# EAGLE design kitt (EAGLE 7.6.0)
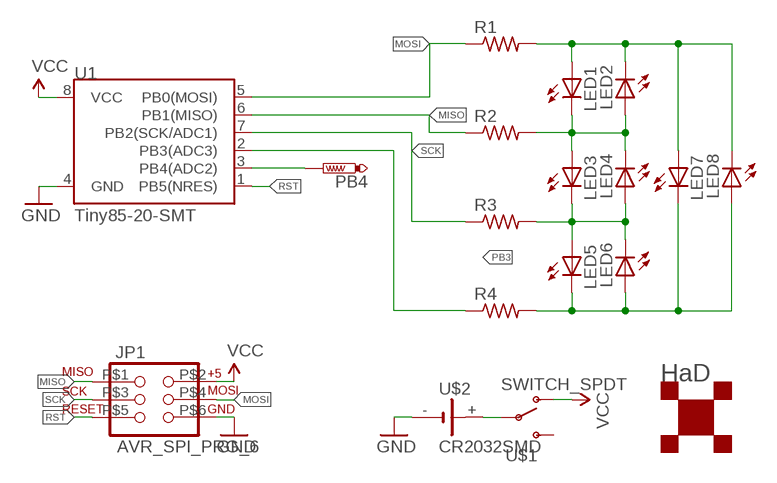
[diagram p0: schematic, sheet 1]

## Parts
JP1  AVR_SPI_PRG_6  [2X3_SMD_PAD]
LED1  LEDCHIPLED-0603-TTW  [CHIPLED-0603-TTW]
LED2  LEDCHIPLED-0603-TTW  [CHIPLED-0603-TTW]
LED3  LEDCHIPLED-0603-TTW  [CHIPLED-0603-TTW]
LED4  LEDCHIPLED-0603-TTW  [CHIPLED-0603-TTW]
LED5  LEDCHIPLED-0603-TTW  [CHIPLED-0603-TTW]
LED6  LEDCHIPLED-0603-TTW  [CHIPLED-0603-TTW]
LED7  LEDCHIPLED-0603-TTW  [CHIPLED-0603-TTW]
LED8  LEDCHIPLED-0603-TTW  [CHIPLED-0603-TTW]
PB4  PTR1B1,27  [B1,27]
R1  R-US_R0603  [R0603]
R2  R-US_R0603  [R0603]
R3  R-US_R0603  [R0603]
R4  R-US_R0603  [R0603]
U1  Tiny85-20-SMT  ATTINY45TINY85-20-SMT  [SO08-EIAJ]
U$1  SWITCH_SPDT  [KPS-1290]
U$2  CR2032SMD  [CR2032SMD]
U$3  HACKADAY_1CM  [HACKADAY_LOGO]

## Nets
MISO: JP1.P$1 R2.1 U1.6(PB1(MISO))
MOSI: JP1.P$4 R1.1 U1.5(PB0(MOSI))
N$1: PB4.TP U1.3(PB4(ADC2))
N$5: U$1.P U$2.+
N$9: LED1.A@1(A) LED2.C@1(C) LED7.A@1(A) LED8.C@1(C) R1.2
N$10: LED5.C@1(C) LED6.A@1(A) LED7.C@1(C) LED8.A@1(A) R4.2
N$11: LED1.C@1(C) LED2.A@1(A) LED3.A@1(A) LED4.C@1(C) R2.2
N$12: LED3.C@1(C) LED4.A@1(A) LED5.A@1(A) LED6.C@1(C) R3.2
N$12222: JP1.P$6 U1.4(GND) U$2.- ; supply symbol labelled GND
PB3: R4.1 U1.2(PB3(ADC3))
RST: JP1.P$5 U1.1(PB5(NRES))
SCK: JP1.P$3 R3.1 U1.7(PB2(SCK/ADC1))
VCC: JP1.P$2 U1.8(VCC) U$1.O
Unconnected: U$1.S

## Library data of the parts
JP1 = SparkFun-Connectors:AVR_SPI_PRG_6: AVR ISP 6 Pin This is the reduced ISP connector for AVR programming. Common on Arduino. This footprint will take up less PCB space and can be used with a 10-pin to 6-pin adapter such as SKU: BOB-08508 **Special note about "TEST_POINT" package. The stop mask is on the top side, so if you want your programming test points to be on the bottom of your board, make sure to place this package on the bottom side of the board. This also ensure that the orientation to program from the bottom side will be correct.
LED1-LED8 = adafruit:LED: LED OSRAM: - CHIPLED LG R971, LG N971, LY N971, LG Q971, LY Q971, LO R971, LY R971 LH N974, LH R974 LS Q976, LO Q976, LY Q976 LO Q996 - Hyper CHIPLED LW Q18S LB Q993, LB Q99A, LB R99A - SideLED LS A670, LO A670, LY A670, LG A670, LP A670 LB A673, LV A673, LT A673, LW A673 LH A674 LY A675 LS A676, LA A676, LO A676, LY A676, LW A676 LS A679, LY A679, LG A679 - Hyper Micro SIDELED® LS Y876, LA Y876, LO Y876, LY Y876 LT Y87S - SmartLED LW L88C, LW L88S LB L89C, LB L89S, LG L890 LS L89K, LO L89K, LY L89K LS L896, LA L896, LO L896, LY L896 - TOPLED LS T670, LO T670, LY T670, LG T670, LP T670 LSG T670, LSP T670, LSY T670, LOP T670, LYG T670 LG T671, LOG T671, LSG T671 LB T673, LV T673, LT T673, LW T673 LH T674 LS T676, LA T676, LO T676, LY T676, LB T676, LH T676, LSB T676, LW T676 LB T67C, LV T67C, LT T67C, LS T67K, LO T67K, LY T67K, LW E67C LS E67B, LA E67B, LO E67B, LY E67B, LB E67C, LV E67C, LT E67C LW T67C LS T679, LY T679, LG T679 LS T770, LO T770, LY T770, LG T770, LP T770 LB T773, LV T773, LT T773, LW T773 LH T774 LS E675, LA E675, LY E675, LS T675 LS T776, LA T776, LO T776, LY T776, LB T776 LHGB T686 LT T68C, LB T68C - Hyper Mini TOPLED® LB M676 - Mini TOPLED Santana® LG M470 LS M47K, LO M47K, LY M47K Source: http://www.osram.convergy.de/
PB4 = testpad:PTR1: TEST PIN
R1-R4 = adafruit:R-US_: RESISTOR, American symbol
U1 = SparkFun-DigitalIC:ATTINY45: Atmel 8-pin 2/4/8kB flash uC; PROD_ID: IC-09092
U$1 = SparkFun-Electromechanical:SWITCH_SPDT: SWCH-10651 Side-actuated SPDT slide switch, as used on the Arduino Pro; PROD_ID: SWCH-10651
U$2 = battery:CR2032SMD
U$3 = LOGOS:HACKADAY_1CM

## Board
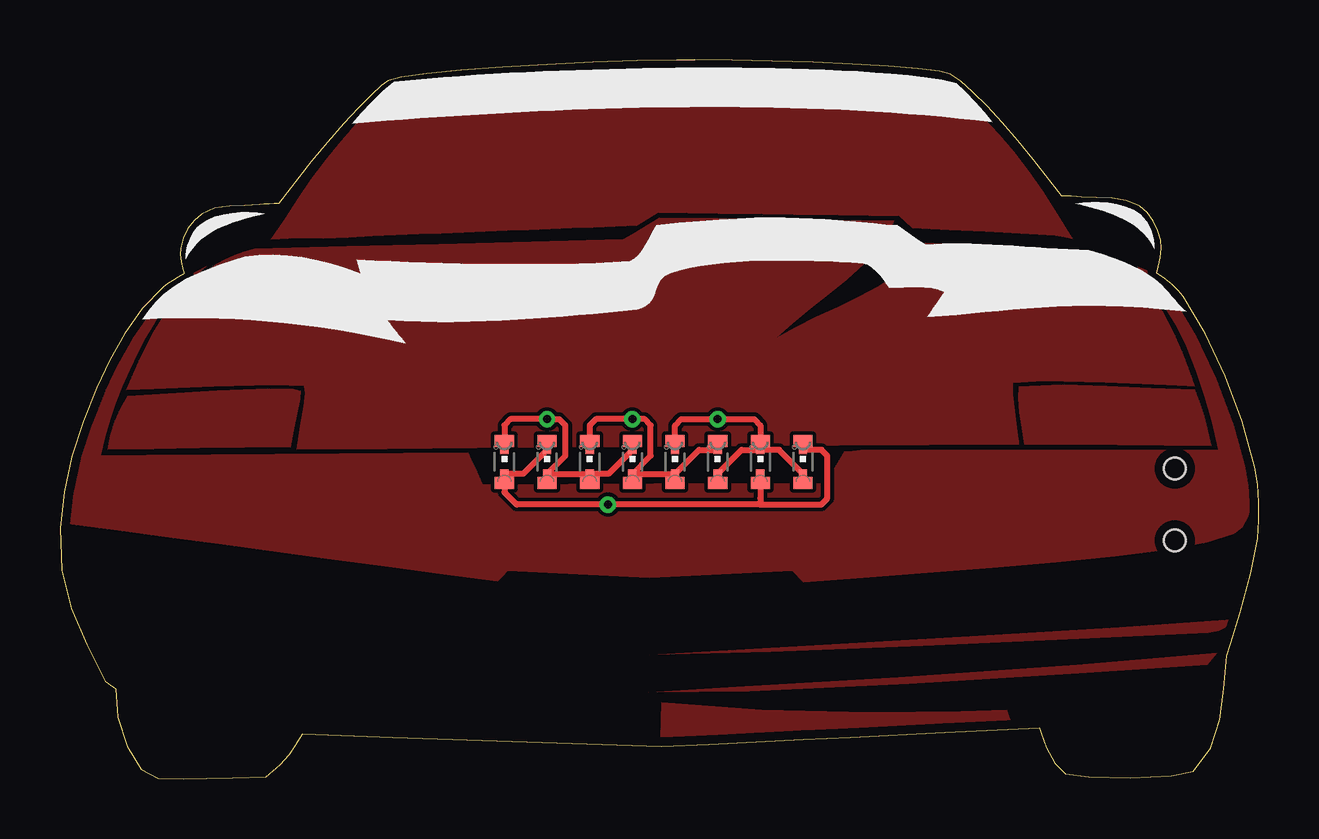
[diagram p1: board, top side]
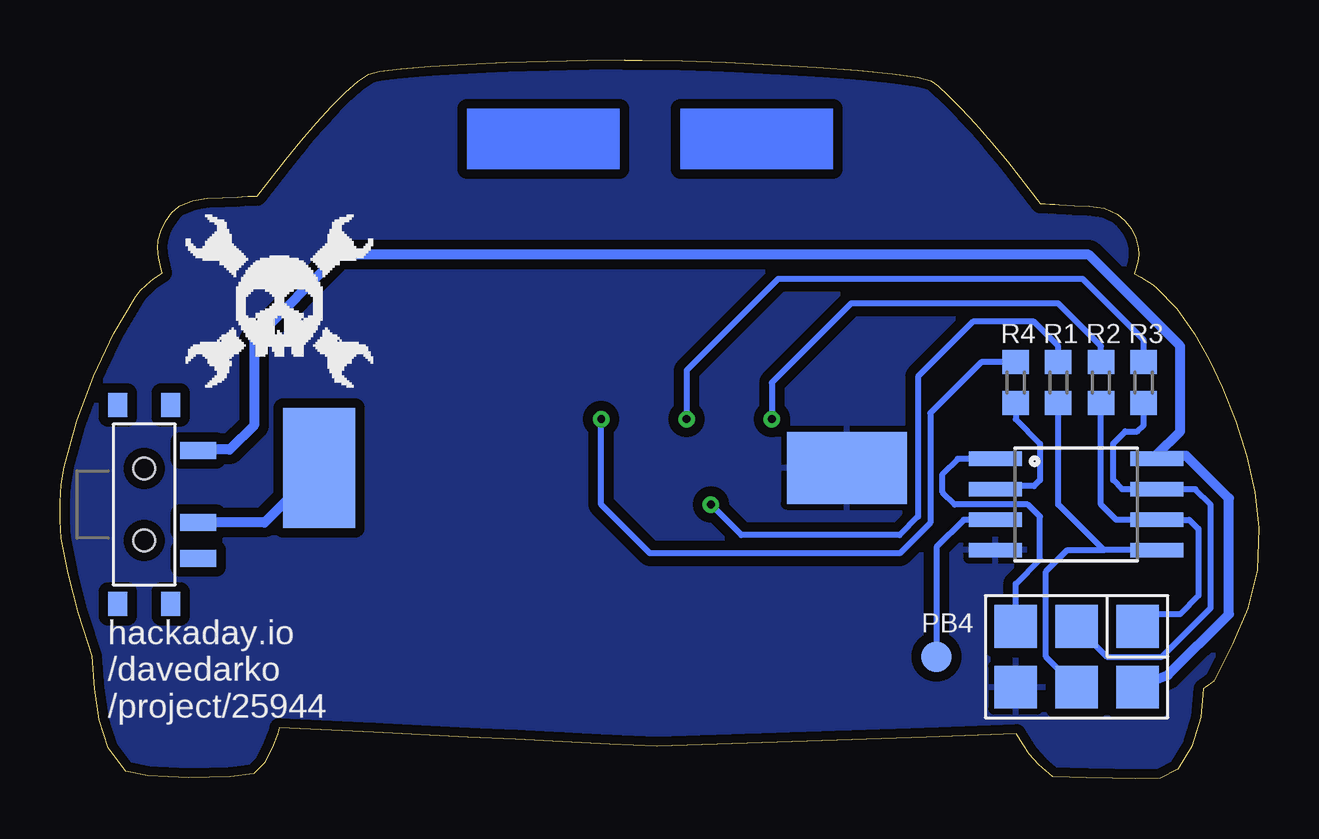
[diagram p2: board, bottom side, seen from below]

Size 49.98 x 29.96 mm. Coordinates in mm from the lower left corner, seen from the top.
Outline: 26.44,29.96 26.34,29.96 26.25,29.96 26.15,29.96 26.06,29.96 25.96,29.96 25.87,29.96 25.78,29.96 25.69,29.96 24.05,29.93 22.22,29.86 20.31,29.77 18.44,29.66 16.72,29.54 15.28,29.4 14.22,29.25 13.67,29.1 13.39,28.89 12.96,28.5 12.43,27.96 11.82,27.3 11.15,26.54 10.46,25.72 9.11,23.97 8.92,23.96 8.71,23.95 8.51,23.94 8.33,23.93 7.7,23.89 7.07,23.87 6.45,23.78 5.9,23.54 5.58,23.26 5.33,22.92 5.14,22.53 5.02,22.13 5.01,21.86 5.06,21.55 5.12,21.26 5.19,21.05 4.93,20.91 4.7,20.77 4.49,20.63 4.3,20.49 3.42,19.59 2.69,18.56 2.07,17.45 1.53,16.31 0.96,14.9 0.5,13.44 0.17,11.95 0,10.44 0.07,8.68 0.47,7.11 1.11,5.6 1.89,4.05 2,3.97 2.11,3.89 2.22,3.82 2.32,3.74 2.42,2.56 2.8,1.35 3.39,0.4 4.1,0.01 5.16,0 6.12,0.01 7.19,0.04 8.59,0.08 9.18,0.57 9.57,1.01 9.85,1.44 10.12,1.86 13.86,1.73 15.73,1.66 17.6,1.6 19.47,1.53 21.34,1.47 23.21,1.4 25.08,1.34 27.05,1.44 29.02,1.53 30.99,1.63 32.96,1.73 36.89,1.93 40.83,2.13 40.91,1.87 41.12,1.29 41.46,0.65 41.9,0.2 42.88,0.07 44.61,0.04 46.32,0.11 47.24,0.3 47.96,1.28 48.34,2.45 48.52,3.75 48.63,5.12 48.81,5.65 49.21,6.94 49.64,8.55 49.92,10.02 49.97,10.76 49.98,11.51 49.92,12.25 49.79,12.99 49.27,14.89 48.58,16.79 47.75,18.56 46.83,20.09 46.62,20.35 46.37,20.6 46.06,20.84 45.72,21.08 45.79,21.36 45.86,21.72 45.9,22.11 45.88,22.45 45.75,22.86 45.57,23.24 45.32,23.59 45,23.86 44.45,24.1 43.83,24.2 43.2,24.22 42.57,24.25 42.38,24.27 42.16,24.28 41.94,24.29 41.75,24.29 40.57,25.82 39.93,26.59 39.28,27.34 38.65,28.03 38.06,28.61 37.54,29.08 37.12,29.38 36.66,29.49 35.76,29.6 34.52,29.7 33.04,29.79 31.39,29.86 29.68,29.92 28,29.95 26.44,29.96
Outline: 26.44,29.96 26.44,29.96
Outline: 26.44,29.96 26.44,29.96
Copper layers (1*16): Top 0.0356mm / dielectric 1.5011mm / Bottom 0.0356mm
Design rules "LaenPCBOrder *": minimum track width 6mil, minimum drill 13mil, track to track 6mil, track to pad 6mil, pad to pad 6mil, via to via 6mil, smd to smd 6mil, copper to edge 15mil, drill to drill 6mil, minimum pad ring 7mil, minimum via ring 7mil, stop-mask expansion 3mil, vias tented up to drill 200mil, thermal gap 10mil

### Footprints (pad centres in the part's own frame; a part is rotated, then mirrored left to right if it is on the bottom)
2X3_SMD_PAD = smd 1.778 x 1.778: P$1 -1.27,2.54; P$2 1.27,2.54; P$3 -1.27,0; P$4 1.27,0; P$5 -1.27,-2.54; P$6 1.27,-2.54
CHIPLED-0603-TTW = smd 0.8 x 0.5: A 0,-0.875; C 0,0.875 | smd 0.35 x 0.35: A@1 0,-0.5; C@1 0,0.5
B1,27 = smd 1.27 x 1.27: TP 0,0
R0603 = smd 1 x 1.1: 1 -0.85,0; 2 0.85,0
SO08-EIAJ = smd 0.61 x 2.21: 1 -1.905,-3.378; 2 -0.635,-3.378; 3 0.635,-3.378; 4 1.905,-3.378; 5 1.905,3.353; 6 0.635,3.353; 7 -0.635,3.353; 8 -1.905,3.353
KPS-1290 = smd 0.7 x 1.5: O -2.25,2.25; P 0.75,2.25; S 2.25,2.25 | smd 1 x 0.8: P$1 -4.15,1.1; P$2 -4.15,-1.1; P$3 4.15,-1.1; P$4 4.15,1.1 | hole 0.9: -1.5,0; 1.5,0
CR2032SMD = smd 5 x 3: + 0,-11 | smd 3 x 5: - 0,11

### Placement (x,y rotation side)
JP1  7.6,5.08 270 bottom
LED1  18.52,13.21 0 top
LED2  20.3,13.21 0 top
LED3  22.08,13.21 0 top
LED4  23.86,13.21 0 top
LED5  25.64,13.21 0 top
LED6  27.41,13.21 0 top
LED7  29.19,13.21 0 top
LED8  30.97,13.21 0 top
PB4  13.44,5.08 0 bottom
R1  8.36,16.51 90 bottom
R2  6.59,16.51 90 bottom
R3  4.81,16.51 90 bottom
R4  10.14,16.51 90 bottom
U1  7.6,11.43 270 bottom
U$1  46.46,11.43 270 bottom
U$2  28.18,12.95 270 bottom
U$3  40.88,19.56 0 bottom

### Tracks (layer width: path | path; a pad name or v marks a point on that pad's centre or on a via)
MISO
  Bottom 0.254: R2.1 6.59,11.43 5.95,10.79 U1.6 2.9,10.79 2.52,10.41 2.52,7.62 3.28,6.86 4.81,6.86 JP1.P$1
MOSI
  Bottom 0.254: U1.5 5.32,9.52 6.46,9.52 | 6.46,9.52 8.36,11.43 R1.1 | JP1.P$4 8.87,5.08 8.87,8.64 7.98,9.52 6.46,9.52
N$1
  Bottom 0.254: U1.3 12.3,10.79 13.44,9.65 PB4.TP
N$5
  Bottom 0.406: U$2.+ 41.45,10.68 U$1.P
N$6
  pour Top: 25.07,3.19 25.05,2.43 25.03,1.67 28.7,1.82 32.36,1.97 36.03,2.12 39.7,2.27 39.58,2.57 39.46,2.86 37.56,2.8 33.78,2.77 29.24,2.86
  pour Top: 6.11,21.36 4.76,20.66 3.6,19.55 2.63,18.17 1.83,16.68 1.29,15.19 0.78,13.69 0.57,12.94 0.39,12.18 0.26,11.42 0.18,10.65 2.43,10.34 4.69,10.04 6.95,9.73 9.21,9.43 11.47,9.13 13.72,8.82 15.98,8.52 18.24,8.21 18.45,8.44 18.66,8.67 24.57,8.37 30.53,8.67 30.99,8.18 33.46,8.38 36.13,8.58 38.85,8.79 41.51,9.01 43.98,9.26 46.12,9.53 47.81,9.84 48.92,10.19 49.28,10.47 49.52,10.89 49.66,11.37 49.7,11.85 49.59,12.99 49.3,14.24 48.89,15.54 48.44,16.81 47.99,17.82 47.5,18.77 46.95,19.65 46.36,20.47 45.97,20.8 45.6,21.04 45.24,21.22 44.9,21.35 45.46,20.57 46,19.75 46.5,18.9 46.94,18.02 47.37,16.98 47.73,15.91 48.02,14.82 48.27,13.73 40.83,13.71 33.39,13.69 33.05,13.66 32.71,13.63 32.3,12.98 31.9,12.33 24.76,12.3 17.62,12.27 17.47,12.6 17.32,12.93 17.16,13.26 17.01,13.6 3.61,13.48 1.7,13.47 1.88,14.26 2.09,14.98 2.33,15.66 2.59,16.35 2.9,17.03 3.27,17.78 3.58,18.38 3.71,18.62 4.17,19.38 4.74,20.08 5.39,20.73
  pour Top: 2.77,16.19 3.9,16.25 6.4,16.35 8.94,16.42 10.18,16.37 10.23,16.08 10.15,15.51 10,14.71 9.87,13.73 13.63,13.75 17.39,13.78 21.16,13.81 28.68,13.86 32.45,13.88 36.21,13.91 39.97,13.94 39.97,14.04 39.93,14.31 39.82,15.14 39.72,16.01 39.73,16.49 40.98,16.58 43.58,16.52 46.14,16.41 46.98,16.37 47.3,16.35 47.08,16.98 46.78,17.76 46.4,18.62 45.94,19.49 45.4,20.32 44.78,21.04 44.07,21.59 43.28,21.9 42.38,21.96 41.48,22.01 39.68,22.13 37.88,22.24 36.08,22.35 34.89,21.05 34.13,20.54 33.3,20.09 32.42,19.67 31.54,19.26 30.67,18.83 29.85,18.36 30.54,18.98 31.29,19.59 32.06,20.2 32.81,20.81 33.49,21.43 34.08,22.04 34.78,23.26 32.33,23.29 29.88,23.33 27.44,23.36 24.99,23.39 24.61,23.17 24.24,22.94 23.87,22.71 23.49,22.48 19.65,22.39 15.81,22.29 11.96,22.19 8.12,22.09 7.68,21.98 7.28,21.83 6.9,21.67 6.55,21.48 5.9,21.03 5.3,20.51 4.5,19.57 3.84,18.53 3.28,17.4
  pour Top: 2.82,15.96 6.56,16.17 8.73,16.26 9.74,16.25 10.02,16.15 10.01,15.82 9.89,15.22 9.74,14.52 9.61,13.82 7.71,13.8 5.8,13.77 3.9,13.75 1.99,13.72 2.1,14.31 2.29,14.89 2.54,15.46
  pour Top: 8.79,22.47 9.9,22.53 10.97,22.52 12,22.56 13.01,22.61 13.99,22.65 14.95,22.69 15.89,22.73 16.82,22.77 17.73,22.8 18.63,22.84 19.53,22.87 20.43,22.91 21.32,22.94 22.23,22.98 23.14,23.01 24.06,23.05 24.5,23.32 24.93,23.6 25.56,23.59 26.18,23.58 26.81,23.57 27.43,23.57 28.06,23.56 28.68,23.55 29.31,23.54 29.93,23.53 30.56,23.52 31.19,23.51 31.83,23.51 32.46,23.5 33.09,23.49 33.72,23.48 34.35,23.47 34.98,23.46 35.25,23.21 35.53,22.96 37.07,22.88 38.58,22.8 40.05,22.72 41.49,22.64 41.86,22.57 42.23,22.5 41.58,23.54 40.97,24.49 40.37,25.35 39.76,26.14 39.14,26.87 38.48,27.55 37.77,28.2 37,28.83 36.55,28.99 35.71,29.12 34.52,29.24 33.03,29.33 32.2,29.37 31.32,29.4 30.4,29.43 29.44,29.45 28.45,29.47 27.43,29.48 26.41,29.48 25.38,29.48 24.34,29.47 23.32,29.46 22.31,29.44 21.32,29.42 20.36,29.39 19.43,29.36 18.55,29.32 17.72,29.27 16.24,29.16 15.05,29.03 14.21,28.87 13.77,28.69 13.03,28.01 12.34,27.3 11.69,26.56 11.07,25.78 10.48,24.98 9.9,24.15 9.34,23.29
  pour Top: 39.97,16.35 41.8,16.42 43.64,16.38 45.47,16.29 47.3,16.22 47.5,15.67 47.69,15.1 47.85,14.5 47.98,13.87 46.04,13.89 44.09,13.91 42.14,13.92 40.2,13.94 40.09,14.62 39.99,15.27 39.94,15.86
N$7
  pour Top: 24.57,5.16 29.62,5.29 35.97,5.53 42.45,5.82 47.87,6.08 48.29,6.16 48.56,6.29 48.73,6.46 48.88,6.63 44.15,6.3 37.93,5.93 31.1,5.54
N$8
  pour Top: 24.52,3.6 28.71,3.64 35.39,3.96 42.46,4.38 47.82,4.75 47.93,4.87 48.03,5 48.13,5.13 48.23,5.25 42.39,4.74 34.94,4.23 28.21,3.82
N$9  (via drill 0.33)
  Top 0.254: 29.19,11.68 LED7.A@1 29.19,11.43 | 29.19,11.43 31.73,11.43 31.99,11.68 31.99,13.46 31.74,13.71 LED8.C@1 | 29.19,11.43 v22.84,11.43 19.03,11.43 18.52,11.94 LED1.A@1 19.3,12.71 LED2.C@1
  Bottom 0.254: R1.2 8.36,18.03 9.38,19.05 11.92,19.05 14.21,16.76 14.21,10.92 14.97,10.16 21.57,10.16 v22.84,11.43
N$10  (via drill 0.33)
  Top 0.254: LED6.A@1 28.41,13.71 LED7.C@1 | LED8.A@1 29.97,13.71 LED7.C@1 | LED5.C@1 25.64,14.73 25.89,14.99 v27.41,14.99 28.94,14.99 29.19,14.73 LED7.C@1
  Bottom 0.254: R4.2 11.58,17.36 13.7,15.24 13.7,10.67 14.97,9.4 25.38,9.4 27.41,11.43 v27.41,14.99
N$11  (via drill 0.33)
  Top 0.254: LED4.C@1 22.86,12.71 LED3.A@1 LED2.A@1 21.06,13.46 21.06,14.73 20.81,14.99 v20.3,14.99 18.78,14.99 18.52,14.73 LED1.C@1
  Bottom 0.254: R2.2 6.59,18.03 8.36,19.81 17,19.81 20.3,16.51 v20.3,14.99
N$12  (via drill 0.33)
  Top 0.254: LED6.C@1 26.64,13.71 LED5.A@1 LED4.A@1 24.62,13.47 24.62,14.73 24.37,14.99 v23.86,14.99 22.33,14.99 22.08,14.73 LED3.C@1
  Bottom 0.254: R3.2 4.81,18.29 7.35,20.83 20.05,20.83 23.86,17.02 v23.86,14.99
N$12222
  pour Bottom (isolate 0.406): -2.56,33.02 50.78,33.02 50.78,-2.54 -2.56,-2.54
PB3
  Bottom 0.254: R4.1 10.14,14.99 9.13,13.97 9.13,12.45 9.38,12.19 10.85,12.19 U1.2
RST
  Bottom 0.254: U1.1 12.56,13.33 13.19,12.7 13.19,11.94 12.68,11.43 9.63,11.43 9.13,10.92 9.13,9.14 10.14,8.13 JP1.P$5
SCK
  Bottom 0.254: R3.1 4.81,14.73 5.06,14.48 5.57,14.48 6.08,13.97 6.08,12.45 5.7,12.06 U1.7 2.65,12.06 2.01,11.43 2.01,7.11 4.05,5.08 6.33,5.08 JP1.P$3
VCC
  Bottom 0.254: 4.12,13.46 U1.8 4.25,13.51
  Bottom 0.406: JP1.P$2 3.79,4.32 1.25,6.86 1.25,11.68 3.03,13.46 4.12,13.46 | 4.25,13.51 3.28,14.48 3.28,18.03 7.09,21.84 38.34,21.84 41.89,18.29 41.89,14.73 42.91,13.72 44.18,13.72 U$1.O
(copper drawn outside any net)
  shapes: Bottom area x2

### Text on the board
bNames: hackaday.io / /davedarko / /project/25944